# Altium project SPI JoyStick IC.PrjPcb
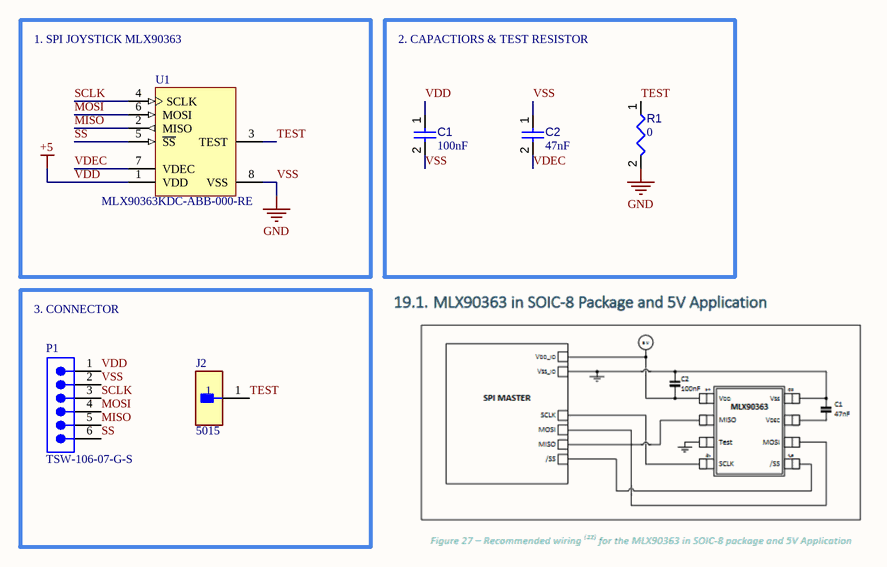
[diagram p0: MLX90363.SchDoc]
1 sheet, 6 parts. Net scope: global (net labels, ports and power ports of the same name join across sheets).
Board file: PCB1.PcbDoc

## Sheet MLX90363.SchDoc
size A4; SheetNumber: 1; SheetTotal: 1

### Parts
C1  value 100nF  [CAPC0402(1005)60_L]  (hidden comment: Capacitor 100nF +/-20% 25V 0402)
C2  value 47nF  [CAPC0402(1005)60_L]  (hidden comment: Capacitor 47nF +/-20% 50V 0402)
J2  5015  [FP-5015-MFG]
P1  TSW-106-07-G-S  [SMTC-TSW-106-07-X-S]
R1  value 0  [RESC0402(1005)_L]  (hidden comment: 0R2J)
U1  MLX90363KDC-ABB-000-RE  [MEX-DC-8_L]

### Blocks framed on the sheet
1. SPI JOYSTICK MLX90363: U1
2. CAPACTIORS & TEST RESISTOR: C1 C2 R1
3. CONNECTOR: J2 P1

### Nets
VDD: C1.1 P1.1 U1.1(VDD)  [also labelled +5]
VSS: C1.2 C2.1 P1.2 R1.2 U1.8(VSS)  [also labelled GND]
MISO: P1.5 U1.2(MISO)
MOSI: P1.4 U1.6(MOSI)
SCLK: P1.3 U1.4(SCLK)
SS: P1.6 U1.5(~{SS})
TEST: J2.1 R1.1 U1.3(TEST)
VDEC: C2.2 U1.7(VDEC)

### Library data of the parts
C1 = CMP-001-00065-4: Chip Capacitor, 100nF +/-20%, 25V, 0402, Thickness 0.6 mm; Tolerance: 10%; Max Operating Temperature: 85°C; Min Operating Temperature: -55°C; Pins: 2; Voltage Rating: 25V; Mounting Technology: SMT; Case/Package: 0402
C2 = CMP-001-00071-4: Chip Capacitor, 47nF +/-20%, 50V, 0402, Thickness 0.6 mm; Tolerance: 20%; Pins: 2; Mounting Technology: SMT; Voltage Rating: 50V; Case/Package: 0402; Max Operating Temperature: 85°C; Min Operating Temperature: -55°C
J2 = CMP-00028-00007-1: Test Point Micro Mini SMT Phos Bronze/Silver 1000pc Tape & Reel; Number of Contacts: 1; Plating: Silver; Body Material: Bronze; Color: White; Contact Plating: Silver; Packaging: Tape and Reel; Reach SVHC Compliant: No; Mounting Technology: Surface Mount; Length: 0.105inch; Series: -; Contact Material: Bronze; Lead Free: Lead Free; Termination: SMD/SMT; Material: Bronze,Silver; Height: 0.06inch; RoHS Compliant: Yes; Package Quantity: 1; Thickness: 0.01inch
P1 = CMP-002-00075-1: Conn Unshrouded Header HDR 6 POS 2.54mm Solder ST Top Entry Thru-Hole Bag
R1 = CMP-009-00062-2: Jumper 0402 (1005 Metric); Pins: 2; Mounting Technology: SMT; Case/Package: 0402
U1 = CMP-001-0000-1: Hall Effect Sensor, 20mT Min, 70mT Max, 0.4-2.9V, CMOS, Rectangular, 8 Pin, Surface Mount